# EAGLE schematic Meanwell_FE (EAGLE 9.7.0)

## Sheet 1 of 2
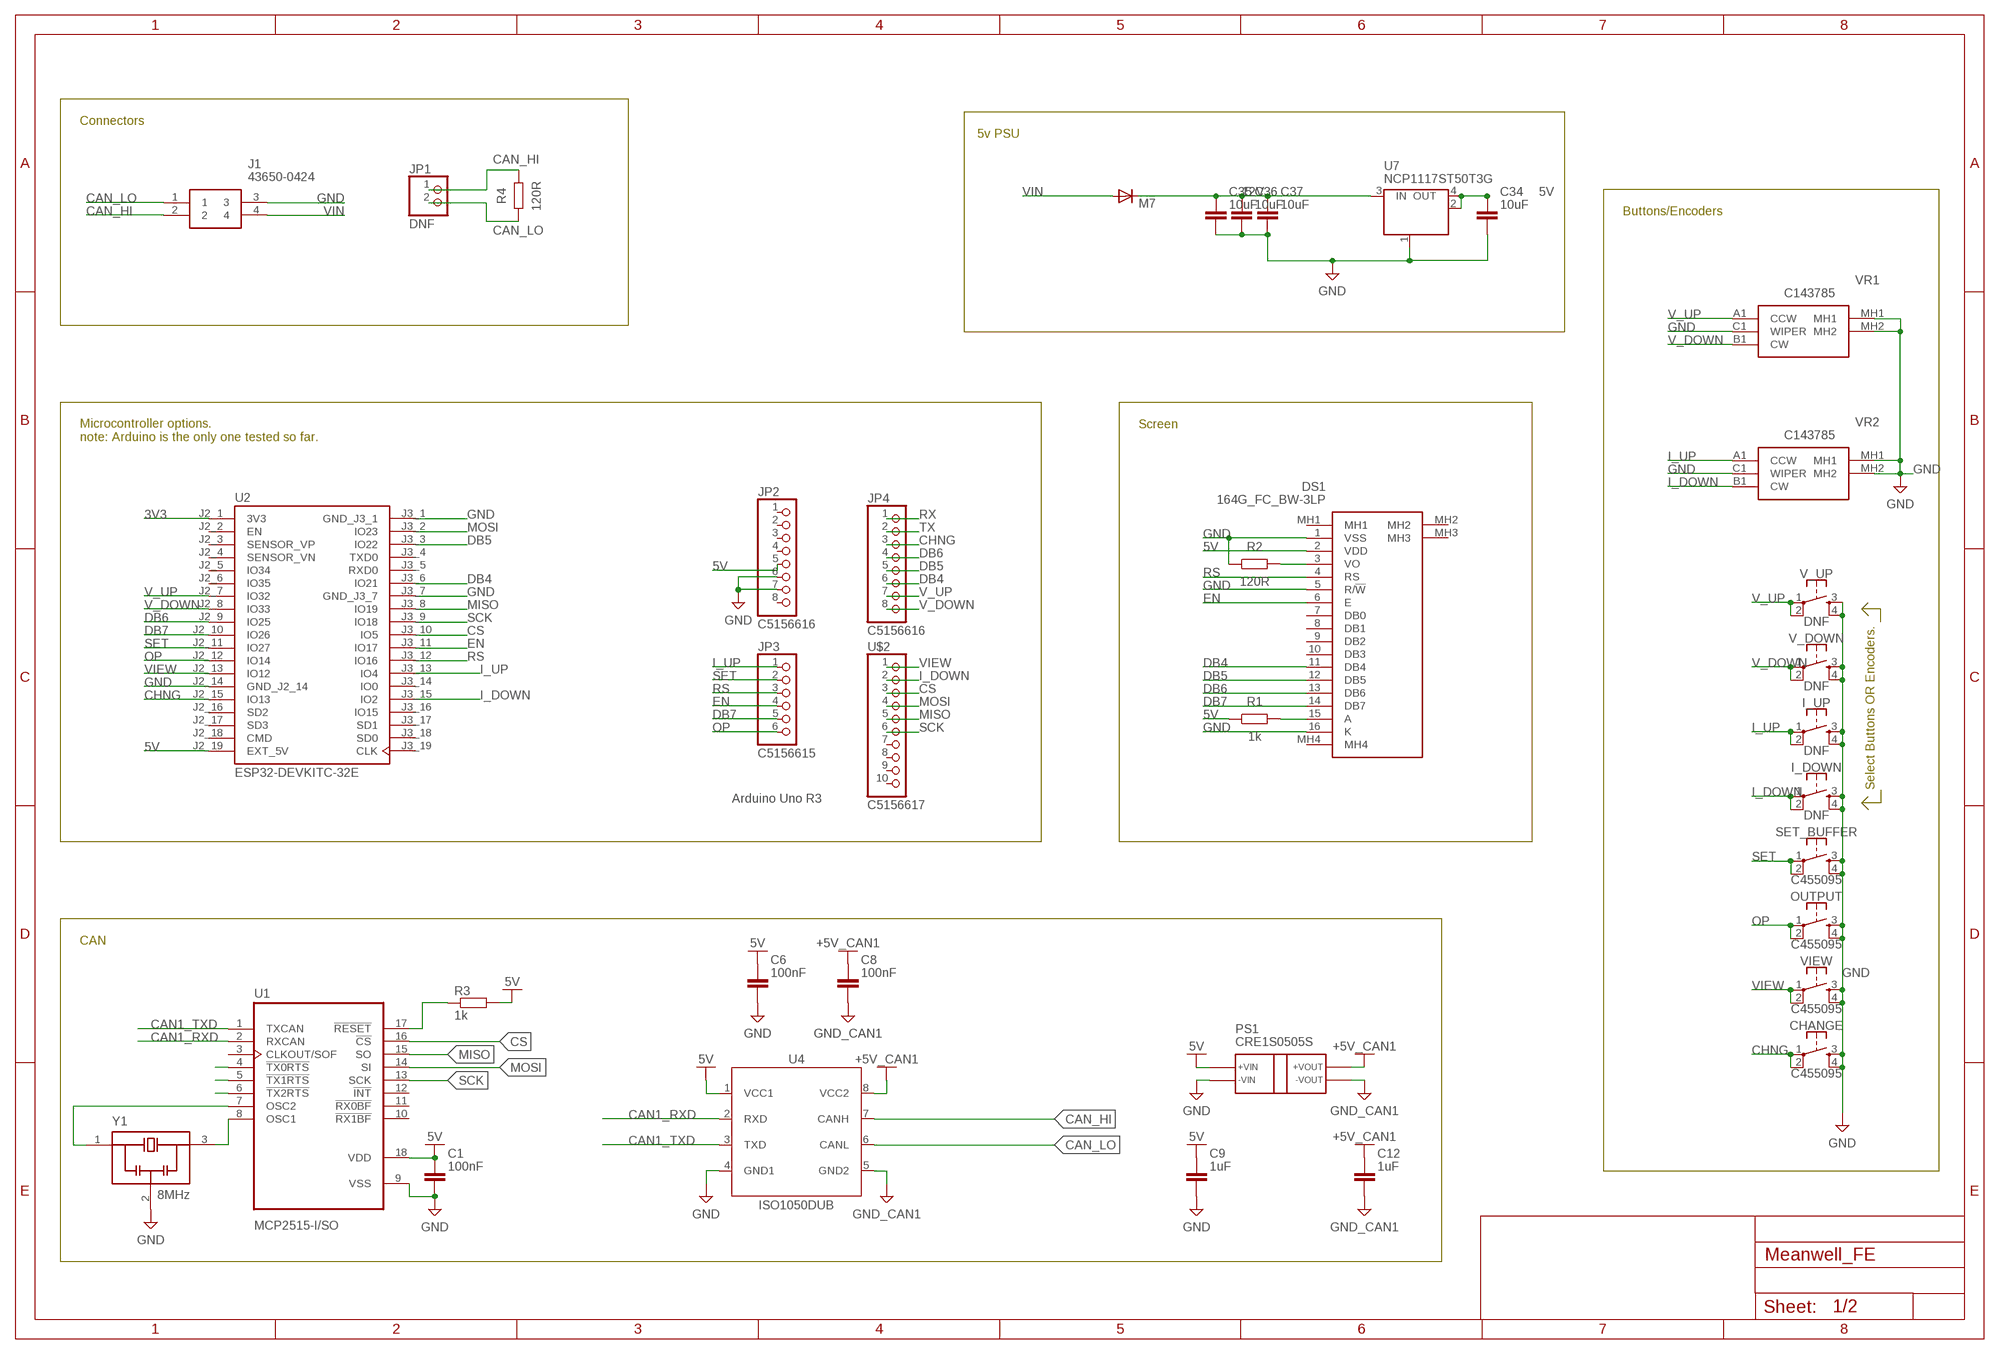
[diagram p0: schematic, sheet 1]

### Parts
C1  100nF  C_CHIP-0603(1608-METRIC)  [CAPC1608X85]
C6  100nF  C_CHIP-0603(1608-METRIC)  [CAPC1608X85]
C8  100nF  C_CHIP-0603(1608-METRIC)  [CAPC1608X85]
C9  1uF  C_CHIP-0603(1608-METRIC)  [CAPC1608X85]
C12  1uF  C_CHIP-0603(1608-METRIC)  [CAPC1608X85]
C34  10uF  C_CHIP-0805(2012-METRIC)  [CAPC2012X110]
C35  10uF  C_CHIP-0805(2012-METRIC)  [CAPC2012X110]
C36  10uF  C_CHIP-0805(2012-METRIC)  [CAPC2012X110]
C37  10uF  C_CHIP-0805(2012-METRIC)  [CAPC2012X110]
CHANGE  C455095  SWITCH_MOMENTARY  [SWITCH-MOMENTARY-PTH-6.5MM]
D1  M7  DIODE-SMB  [SMB]
DS1  164G_FC_BW-3LP  [164GFCBW3LP]
I_DOWN  DNF  SWITCH_MOMENTARY  [SWITCH-MOMENTARY-PTH-6.5MM]
I_UP  DNF  SWITCH_MOMENTARY  [SWITCH-MOMENTARY-PTH-6.5MM]
J1  43650-0424  [43650-04YY_242526]
JP1  DNF  PINHD-1X2  [1X02]
JP2  C5156616  PINHD-1X8BIG  [1X08-BIG]
JP3  C5156615  PINHD-1X6B  [1X06-BIG]
JP4  C5156616  PINHD-1X8BIG  [1X08-BIG]
OUTPUT  C455095  SWITCH_MOMENTARY  [SWITCH-MOMENTARY-PTH-6.5MM]
PS1  CRE1S0505S  [CRE1(SC)]
R1  1k  R_CHIP-0603(1608-METRIC)  [RESC1608X60]
R2  120R  R_CHIP-0603(1608-METRIC)  [RESC1608X60]
R3  1k  R_CHIP-0603(1608-METRIC)  [RESC1608X60]
R4  120R  R_CHIP-0603(1608-METRIC)  [RESC1608X60]
SET_BUFFER  C455095  SWITCH_MOMENTARY  [SWITCH-MOMENTARY-PTH-6.5MM]
U1  MCP2515-I/SO  [SOIC127P1030X265-18N]
U2  ESP32-DEVKITC-32E  [MODULE_ESP32-DEVKITC-32E]
U4  ISO1050DUB  [SOP254P1040X485-8]
U7  NCP1117ST50T3G  MC33269ST-3.3T3  [SOT223]
U$2  C5156617  PINHD-1X10  [1X10-BIG]
V_DOWN  DNF  SWITCH_MOMENTARY  [SWITCH-MOMENTARY-PTH-6.5MM]
V_UP  DNF  SWITCH_MOMENTARY  [SWITCH-MOMENTARY-PTH-6.5MM]
VIEW  C455095  SWITCH_MOMENTARY  [SWITCH-MOMENTARY-PTH-6.5MM]
VR1  C143785  PEC12R-4215F-N0024  [PEC12R4215FN0024]
VR2  C143785  PEC12R-4215F-N0024  [PEC12R4215FN0024]
Y1  8MHz  CSTNE8M00GH5C000R0  [OSC_CSTNE8M00GH5C000R0]

### Nets
3V3: U2.J2_1(3V3)
5V: C1.1 C6.1 C9.1 C34.1 DS1.2(VDD) JP2.5 PS1.2(+VIN) R1.1 R3.2 U1.18(VDD) U2.J2_19(EXT_5V) U4.1(VCC1) U7.2(OUT) U7.4(OUT)
12V: C35.1 C36.1 C37.1 D1.C U7.3(IN)
+5V_CAN1: C8.1 C12.1 PS1.4(+VOUT) U4.8(VCC2)
CAN1_RXD: U1.2(RXCAN) U4.2(RXD)
CAN1_TXD: U1.1(TXCAN) U4.3(TXD)
CAN_HI: J1.2 JP1.1 R4.2 U4.7(CANH)
CAN_LO: J1.1 JP1.2 R4.1 U4.6(CANL)
CHNG: CHANGE.1 CHANGE.2 JP4.3 U2.J2_15(IO13)
CS: U1.16(!CS) U2.J3_10(IO5) U$2.3
DB4: DS1.11(DB4) JP4.6 U2.J3_6(IO21)
DB5: DS1.12(DB5) JP4.5 U2.J3_3(IO22)
DB6: DS1.13(DB6) JP4.4 U2.J2_9(IO25)
DB7: DS1.14(DB7) JP3.5 U2.J2_10(IO26)
EN: DS1.6(E) JP3.4 U2.J3_11(IO17)
GND: C1.2 C6.2 C9.2 C34.2 C35.2 C36.2 C37.2 CHANGE.3 CHANGE.4 DS1.1(VSS) DS1.5(R/!W) DS1.16(K) I_DOWN.3 I_DOWN.4 I_UP.3 I_UP.4 J1.3 JP2.6 JP2.7 OUTPUT.3 OUTPUT.4 PS1.1(-VIN) R2.1 SET_BUFFER.3 SET_BUFFER.4 U1.9(VSS) U2.J2_14(GND_J2_14) U2.J3_1(GND_J3_1) U2.J3_7(GND_J3_7) U4.4(GND1) U7.1(GND/ADJ) V_DOWN.3 V_DOWN.4 V_UP.3 V_UP.4 VIEW.3 VIEW.4 VR1.C1(WIPER) VR1.MH1 VR1.MH2 VR2.C1(WIPER) VR2.MH1 VR2.MH2 Y1.2(GND)
GND_CAN1: C8.2 C12.2 PS1.3(-VOUT) U4.5(GND2)
I_DOWN: I_DOWN.1 I_DOWN.2 U2.J3_15(IO2) U$2.2 VR2.B1(CW)
I_UP: I_UP.1 I_UP.2 JP3.1 U2.J3_13(IO4) VR2.A1(CCW)
MISO: U1.15(SO) U2.J3_8(IO19) U$2.5
MOSI: U1.14(SI) U2.J3_2(IO23) U$2.4
N$1: DS1.3(VO) R2.2
N$6: U1.7(OSC2) Y1.1(IN)
N$8: DS1.15(A) R1.2
N$12: R3.1 U1.17(!RESET)
N$13: U1.8(OSC1) Y1.3(OUT)
N$170: U1.4(!TX0RTS)
N$171: U1.5(!TX1RTS)
N$172: U1.6(!TX2RTS)
OP: JP3.6 OUTPUT.1 OUTPUT.2 U2.J2_12(IO14)
RS: DS1.4(RS) JP3.3 U2.J3_12(IO16)
RX: JP4.1
SCK: U1.13(SCK) U2.J3_9(IO18) U$2.6
SET: JP3.2 SET_BUFFER.1 SET_BUFFER.2 U2.J2_11(IO27)
TX: JP4.2
V_DOWN: JP4.8 U2.J2_8(IO33) V_DOWN.1 V_DOWN.2 VR1.B1(CW)
V_UP: JP4.7 U2.J2_7(IO32) V_UP.1 V_UP.2 VR1.A1(CCW)
VIEW: U2.J2_13(IO12) U$2.1 VIEW.1 VIEW.2
VIN: D1.A J1.4
Unconnected: DS1.7(DB0) DS1.8(DB1) DS1.9(DB2) DS1.10(DB3) DS1.MH1 DS1.MH2 DS1.MH3 DS1.MH4 JP2.1 JP2.2 JP2.3 JP2.4 JP2.8 U1.3(CLKOUT/SOF) U1.10(!RX1BF) U1.11(!RX0BF) U1.12(!INT) U2.J2_2(EN) U2.J2_3(SENSOR_VP) U2.J2_4(SENSOR_VN) U2.J2_5(IO34) U2.J2_6(IO35) U2.J2_16(SD2) U2.J2_17(SD3) U2.J2_18(CMD) U2.J3_4(TXD0) U2.J3_5(RXD0) U2.J3_14(IO0) U2.J3_16(IO15) U2.J3_17(SD1) U2.J3_18(SD0) U2.J3_19(CLK) U$2.7 U$2.8 U$2.9 U$2.10

### Notes on the sheet
- Connectors
- 5v PSU
- Buttons/Encoders
- Screen
- Microcontroller options.
  note: Arduino is the only one tested so far.
- Select Buttons OR Encoders.
- Arduino Uno R3
- CAN

## Sheet 2 of 2
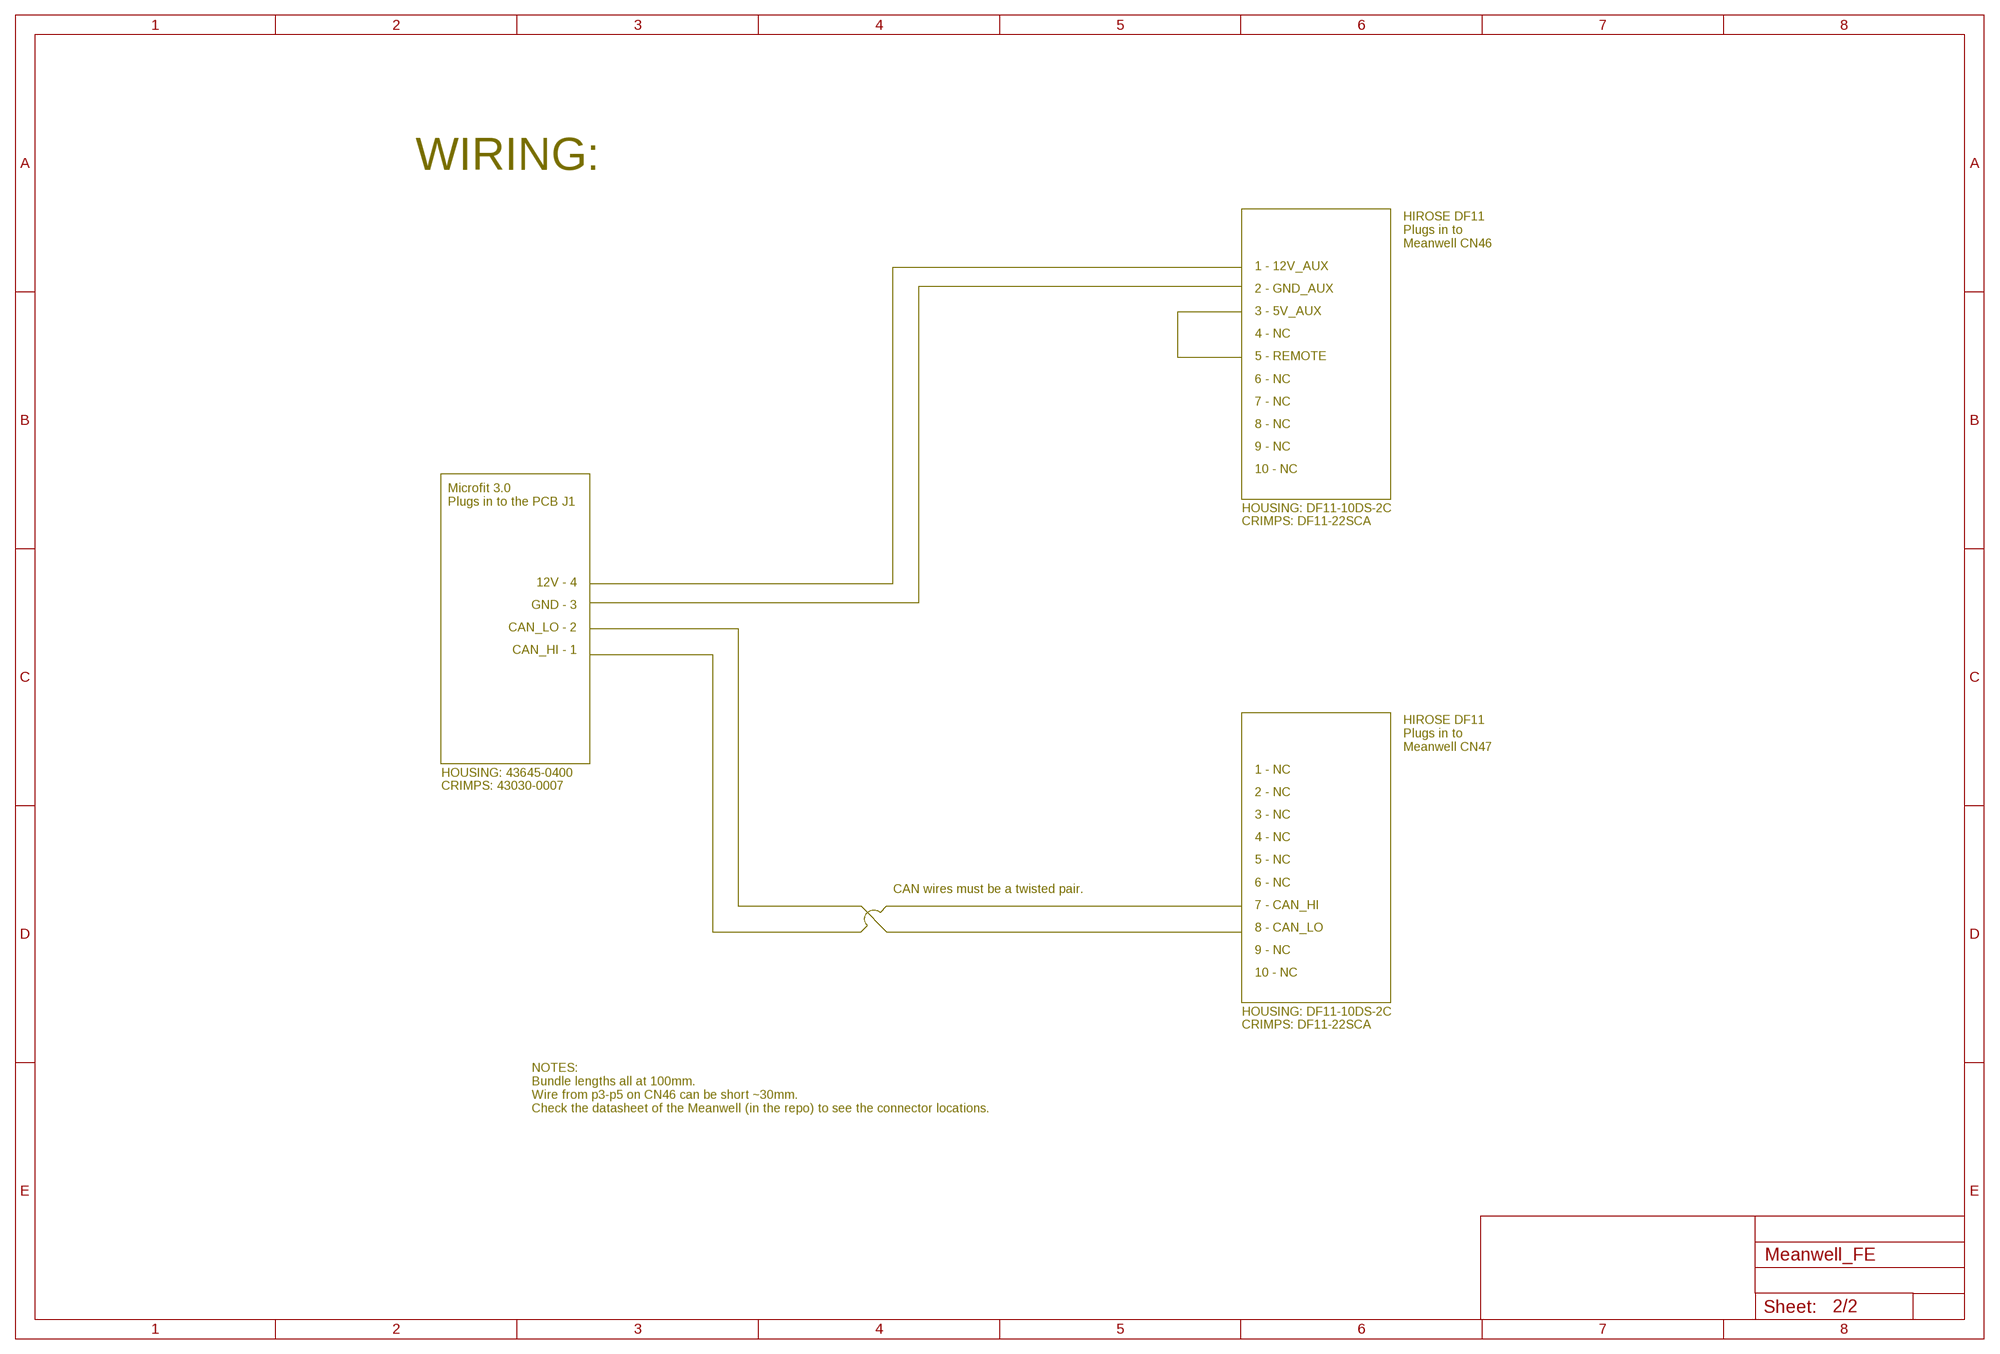
[diagram p1: schematic, sheet 2]

### Notes on the sheet
- WIRING:
- HIROSE DF11
  Plugs in to 
  Meanwell CN46
- 1 - 12V_AUX
  2 - GND_AUX
  3 - 5V_AUX
  4 - NC
  5 - REMOTE
  6 - NC
  7 - NC
  8 - NC
  9 - NC
  10 - NC
- Microfit 3.0
  Plugs in to the PCB J1
- HOUSING: DF11-10DS-2C
- CRIMPS: DF11-22SCA
- 12V - 4
  GND - 3
  CAN_LO - 2
  CAN_HI - 1
- HIROSE DF11
  Plugs in to 
  Meanwell CN47
- HOUSING: 43645-0400
- CRIMPS: 43030-0007
- CAN wires must be a twisted pair.
- 1 - NC
  2 - NC
  3 - NC
  4 - NC
  5 - NC
  6 - NC
  7 - CAN_HI
  8 - CAN_LO
  9 - NC
  10 - NC
- HOUSING: DF11-10DS-2C
- CRIMPS: DF11-22SCA
- NOTES:
  Bundle lengths all at 100mm.
  Wire from p3-p5 on CN46 can be short ~30mm.
  Check the datasheet of the Meanwell (in the repo) to see the connector locations.

## Library data of the parts
C1 C6 C8 C9 C12 = Capacitor:C: Capacitor - Generic; CATEGORY: Capacitor; PACKAGE_SIZE: 0603; PACKAGE_TYPE: SMD; SUBCATEGORY: Ceramic Capacitors; TYPE: MLCC
C34-C37 = Capacitor:C: Capacitor - Generic; CATEGORY: Capacitor; PACKAGE_SIZE: 0805; PACKAGE_TYPE: SMD; SUBCATEGORY: Ceramic Capacitors; TYPE: MLCC
CHANGE I_DOWN I_UP OUTPUT SET_BUFFER V_DOWN V_UP VIEW = Tinkercad:SWITCH_MOMENTARY
D1 = Diode:DIODE-: DIODE
DS1 = Jack'sLib:164G_FC_BW-3LP: LCD Character Display Modules & Accessories 16x4 Char Display FSTN White 6 oclock Source: Datasheet <https://datasheet.datasheetarchive.com/originals/distributors/Datasheets_SAMA/5906eb3b59377bdb5eee9d672233fb3c.pdf>; DESCRIPTION: LCD Character Display Modules & Accessories 16x4 Char Display FSTN White 6 oclock; HEIGHT: 10.6mm; MANUFACTURER_NAME: Displaytech; MANUFACTURER_PART_NUMBER: 164G FC BW-3LP; MOUSER_PART_NUMBER: N/A; MOUSER_PRICE-STOCK: https://www.mouser.co.uk/ProductDetail/Displaytech/164G-FC-BW-3LP?qs=BJlw7L4Cy78q8isRIsBUGg%3D%3D
J1 = Jack'sLib:43650-0424: Micro-Fit 3.0 Vertical Header, 3.00mm Pitch, Single Row, 4 Circuits, with Solder Tab Source: Datasheet <https://www.molex.com/pdm_docs/sd/436500224_sd.pdf>; DESCRIPTION: Micro-Fit 3.0 Vertical Header, 3.00mm Pitch, Single Row, 4 Circuits, with Solder Tab; HEIGHT: 9.9mm; MANUFACTURER_NAME: Molex; MANUFACTURER_PART_NUMBER: 43650-0424; MOUSER_PART_NUMBER: 538-43650-0424; MOUSER_PRICE-STOCK: https://www.mouser.co.uk/ProductDetail/Molex/43650-0424?qs=9hH17QIRXQ1aOH%2Fg6k69OQ%3D%3D
JP1 = Connector:PINHD-1X2: PIN HEADER; CATEGORY: Headers; DESCRIPTION: Header-Straight-2 Position; PACKAGE_TYPE: THT; PITCH: 0.100" (2.54mm); SUBCATEGORY: Headers-Male Pins; TYPE: Board to Board or Cable-Unshrouded-Through Hole-Straight
JP2 JP4 = adafruit:PINHD-1X8: PIN HEADER
JP3 = adafruit:PINHD-1X6: PIN HEADER
PS1 = ISO_DCDCs:CRE1S0505S: Isolated 1W Single Output Isolated DC/DC Converters Source: Datasheet <http://power.murata.com/datasheet?/data/power/ncl/kdc_cre1.pdf>; DESCRIPTION: Isolated 1W Single Output Isolated DC/DC Converters; HEIGHT: mm; MANUFACTURER_NAME: Murata Electronics; MANUFACTURER_PART_NUMBER: CRE1S2405SC; MOUSER_PART_NUMBER: 580-CRE1S2405SC; MOUSER_PRICE-STOCK: https://www.mouser.co.uk/ProductDetail/Murata-Power-Solutions/CRE1S2405SC?qs=pFP7BvE1PmwUsyXD%252BXcXxQ%3D%3D
R1-R4 = Resistor:R: Resistor Fixed - Generic; CATEGORY: Resistors; DESCRIPTION: Chip Resistor 1.60 X 0.82 X 0.60 mm body 0603(1608-METRIC) Package; PACKAGE_SIZE: 0603; PACKAGE_TYPE: SMD
U1 = MCP2515:MCP2515-I/SO: Check availability <https://pricing.snapeda.com/parts/MCP2515-I/SO/Microchip/view-part?ref=eda>; AVAILABILITY: In Stock; CHECK_PRICES: https://www.snapeda.com/parts/MCP2515-I/SO/Microchip/view-part/?ref=eda; DESCRIPTION: Microchip CAN Controller 1Mbit/s CAN 2.0B 18-Pin SOIC W | Microchip Technology Inc. MCP2515-I/SO; MF: Microchip; MP: MCP2515-I/SO; PACKAGE: SOIC-18 Microchip; PRICE: None; SNAPEDA_LINK: https://www.snapeda.com/parts/MCP2515-I/SO/Microchip/view-part/?ref=snap
U2 = Jack'sLib:ESP32-DEVKITC-32E; MANUFACTURER: Espressif Systems; PARTREV: 1.4; STANDARD: Manufacturer Recommendations
U4 = IC_Interface:ISO1050DUB*: Isolated CAN Transceiver SOP-8 Datasheet <https://www.ti.com/lit/ds/symlink/iso1050.pdf?HQS=dis-dk-null-digikeymode-dsf-pf-null-wwe&ts=1611898260031>; CATEGORY: Interface IC; DATASHEET: https://www.ti.com/lit/ds/symlink/iso1050.pdf; DESCRIPTION: 1/1 Transceiver - Isolated Half CANbus 8-SOP; MANUFACTURER: Texas Instruments; MPN: ISO1050DUB; OPERATING_TEMPERATURE: -55°C ~ 105°C; PACKAGE_SIZE: 8-SOP; PACKAGE_TYPE: SMD; PART_STATUS: OBSOLETE; ROHS: COMPLIANT; SERIES: ISO1050; SUBCATEGORY: CANbus Transceiver; TYPE: Isolated Transceiver
U7 = linear:MC33269ST*: Adjustable Output Low Dropout Voltage Regulator 800 mA Source: http://www.onsemi.com/pub/Collateral/MC33269-D.PDF
U$2 = adafruit:PINHD-1X10: Pin header 1x10 0.1" spacing With round pins
VR1 VR2 = Jack'sLib:PEC12R-4215F-N0024: Encoders ENCODER Source: Datasheet <https://www.arrow.com/en/products/pec12r-4215f-n0024/bourns>; DESCRIPTION: Encoders ENCODER; HEIGHT: 15mm; MANUFACTURER_NAME: Bourns; MANUFACTURER_PART_NUMBER: PEC12R-4215F-N0024; MOUSER_PART_NUMBER: 652-PEC12R4215FN0024; MOUSER_PRICE-STOCK: https://www.mouser.co.uk/ProductDetail/Bourns/PEC12R-4215F-N0024?qs=pxDZlBjcsChk7Z90MBi1FA%3D%3D
Y1 = CSTNE8M00GH5C000R0:CSTNE8M00GH5C000R0: Check availability <https://pricing.snapeda.com/parts/CSTNE8M00GH5C000R0/Murata%20Electronics/view-part?ref=eda>; AVAILABILITY: In Stock; CHECK_PRICES: https://www.snapeda.com/parts/CSTNE8M00GH5C000R0/Murata+Electronics+North+America/view-part/?ref=eda; DESCRIPTION: 8 MHz Ceramic Resonator Built in Capacitor 33 pF ±0.13% 40 Ohms -40°C ~ 125°C Surface Mount; MF: Murata Electronics; MP: CSTNE8M00GH5C000R0; PACKAGE: SMD-3 Murata; PRICE: None; SNAPEDA_LINK: https://www.snapeda.com/parts/CSTNE8M00GH5C000R0/Murata+Electronics+North+America/view-part/?ref=snap